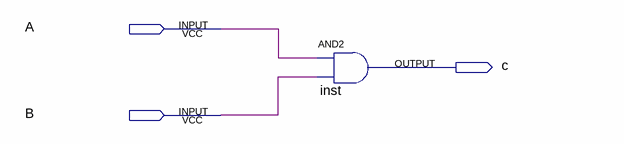
[diagram p0: schematic sheet]
// Quartus schematic lab1step1.bdf as structural Verilog: 1 symbols, 3 pins
module lab1step1 (
  input  A,
  input  B,
  output c
);

  and inst (c, A, B);
endmodule
